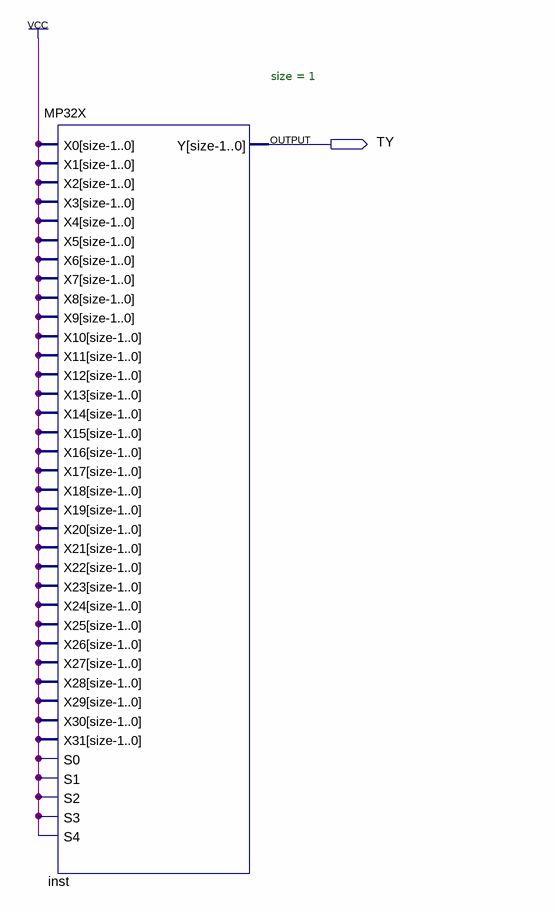
[diagram p0: schematic sheet]
// Quartus schematic QQQQ.bdf as structural Verilog: 1 symbols, 1 pins
module QQQQ (
  output TY
);

  MP32X #(.size(1)) inst (
    .X0(1'b1), .X1(1'b1), .X2(1'b1), .X3(1'b1), .X4(1'b1), .X5(1'b1), .X6(1'b1), .X7(1'b1), .X8(1'b1),
    .X9(1'b1), .X10(1'b1), .X11(1'b1), .X12(1'b1), .X13(1'b1), .X14(1'b1), .X15(1'b1), .X16(1'b1),
    .X17(1'b1), .X18(1'b1), .X19(1'b1), .X20(1'b1), .X21(1'b1), .X22(1'b1), .X23(1'b1), .X24(1'b1),
    .X25(1'b1), .X26(1'b1), .X27(1'b1), .X28(1'b1), .X29(1'b1), .X30(1'b1), .X31(1'b1), .S0(1'b1), .S1(1'b1),
    .S2(1'b1), .S3(1'b1), .S4(1'b1), .Y(TY));
endmodule
